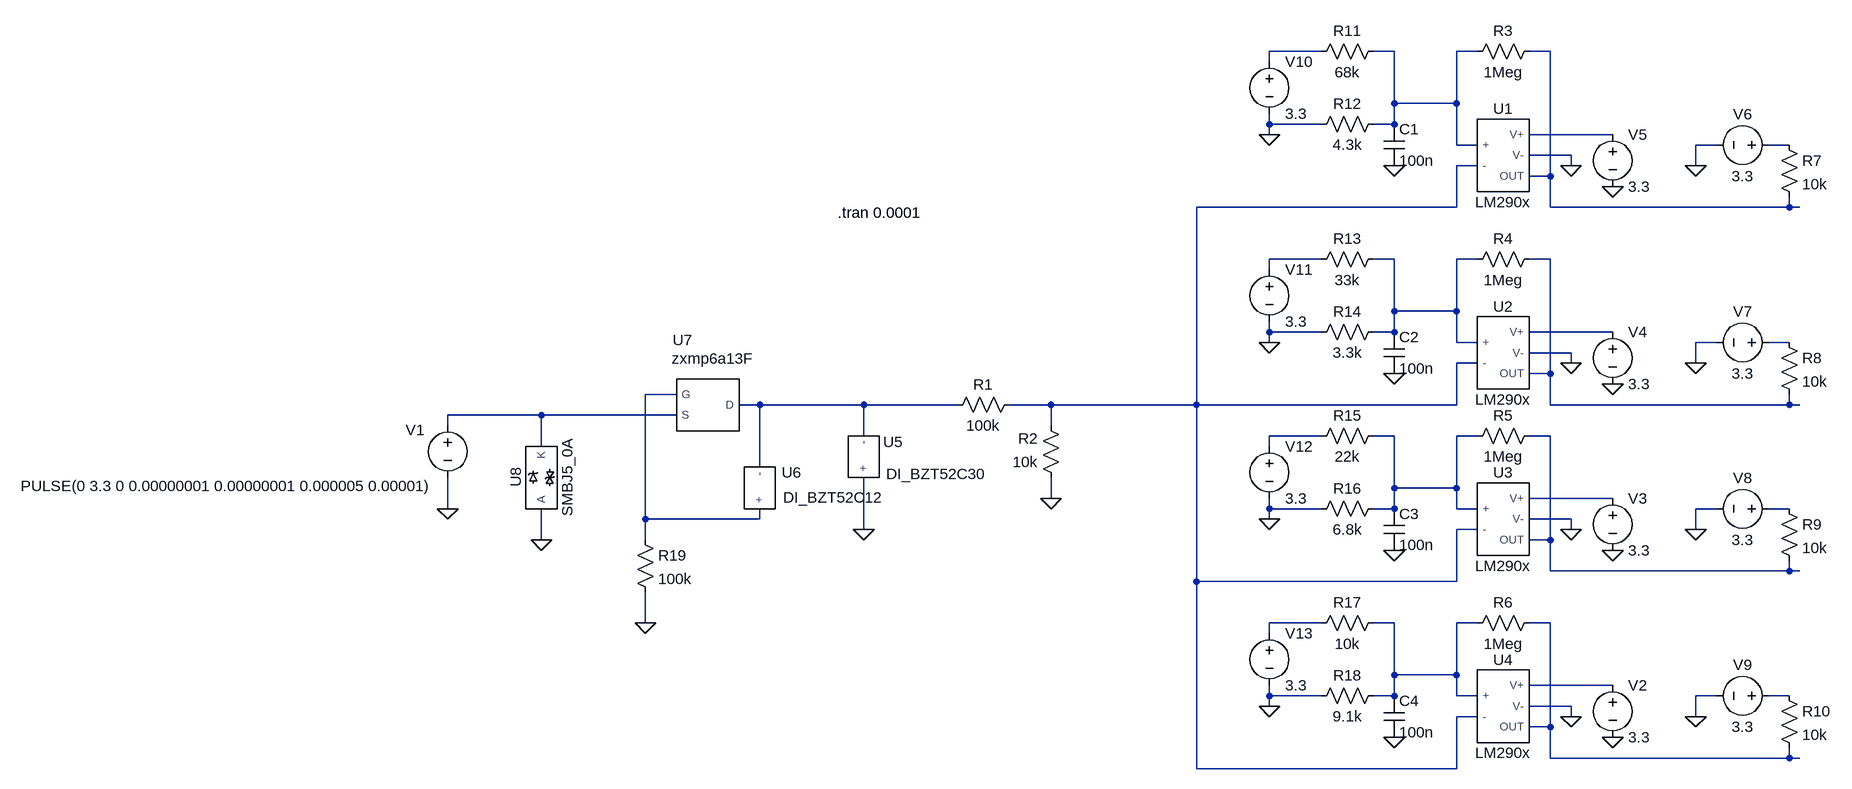
[diagram p0: schematic DigitalInput.asc]
DigitalInput.asc, the LTspice schematic file:
Version 4
SHEET 1 1332 868
WIRE 544 -240 464 -240
WIRE 656 -240 624 -240
WIRE 784 -240 752 -240
WIRE 896 -240 864 -240
WIRE 464 -224 464 -240
WIRE 656 -160 656 -240
WIRE 752 -160 752 -240
WIRE 752 -160 656 -160
WIRE 464 -128 464 -144
WIRE 544 -128 464 -128
WIRE 656 -128 656 -160
WIRE 656 -128 624 -128
WIRE 464 -112 464 -128
WIRE 992 -112 864 -112
WIRE 752 -96 752 -160
WIRE 784 -96 752 -96
WIRE 1152 -96 1120 -96
WIRE 1264 -96 1232 -96
WIRE 928 -80 864 -80
WIRE 784 -64 752 -64
WIRE 928 -64 928 -80
WIRE 1120 -64 1120 -96
WIRE 896 -48 896 -240
WIRE 896 -48 864 -48
WIRE 752 0 752 -64
WIRE 752 0 352 0
WIRE 896 0 896 -48
WIRE 1264 0 1264 -16
WIRE 1264 0 896 0
WIRE 1280 0 1264 0
WIRE 544 80 464 80
WIRE 656 80 624 80
WIRE 784 80 752 80
WIRE 896 80 864 80
WIRE 464 96 464 80
WIRE 656 160 656 80
WIRE 752 160 752 80
WIRE 752 160 656 160
WIRE 464 192 464 176
WIRE 544 192 464 192
WIRE 656 192 656 160
WIRE 656 192 624 192
WIRE 992 192 864 192
WIRE 464 208 464 192
WIRE 752 208 752 160
WIRE 784 208 752 208
WIRE 1152 208 1120 208
WIRE 1264 208 1232 208
WIRE 928 224 864 224
WIRE 784 240 752 240
WIRE 928 240 928 224
WIRE 1120 240 1120 208
WIRE 896 256 896 80
WIRE 896 256 864 256
WIRE -448 288 -496 288
WIRE -320 304 -352 304
WIRE -160 304 -320 304
WIRE -16 304 -160 304
WIRE 128 304 64 304
WIRE 352 304 352 0
WIRE 352 304 128 304
WIRE 752 304 752 240
WIRE 752 304 352 304
WIRE 896 304 896 256
WIRE 1264 304 1264 288
WIRE 1264 304 896 304
WIRE 1280 304 1264 304
WIRE -656 320 -800 320
WIRE -448 320 -656 320
WIRE -800 336 -800 320
WIRE 128 336 128 304
WIRE -160 352 -160 304
WIRE 544 352 464 352
WIRE 656 352 624 352
WIRE 784 352 752 352
WIRE 896 352 864 352
WIRE -656 368 -656 320
WIRE 464 368 464 352
WIRE -320 400 -320 304
WIRE 656 432 656 352
WIRE 752 432 752 352
WIRE 752 432 656 432
WIRE 128 448 128 416
WIRE 992 448 864 448
WIRE -800 464 -800 416
WIRE 464 464 464 448
WIRE 544 464 464 464
WIRE 656 464 656 432
WIRE 656 464 624 464
WIRE 752 464 752 432
WIRE 784 464 752 464
WIRE 1152 464 1120 464
WIRE 1264 464 1232 464
WIRE -496 480 -496 288
WIRE -320 480 -320 464
WIRE -320 480 -496 480
WIRE 464 480 464 464
WIRE 928 480 864 480
WIRE -160 496 -160 416
WIRE 784 496 752 496
WIRE 928 496 928 480
WIRE 1120 496 1120 464
WIRE -656 512 -656 464
WIRE -496 512 -496 480
WIRE 896 512 896 352
WIRE 896 512 864 512
WIRE 896 560 896 512
WIRE 1264 560 1264 544
WIRE 1264 560 896 560
WIRE 1280 560 1264 560
WIRE 352 576 352 304
WIRE 752 576 752 496
WIRE 752 576 352 576
WIRE -496 640 -496 592
WIRE 544 640 464 640
WIRE 656 640 624 640
WIRE 784 640 752 640
WIRE 896 640 864 640
WIRE 464 656 464 640
WIRE 656 720 656 640
WIRE 752 720 752 640
WIRE 752 720 656 720
WIRE 992 736 864 736
WIRE 464 752 464 736
WIRE 544 752 464 752
WIRE 656 752 656 720
WIRE 656 752 624 752
WIRE 752 752 752 720
WIRE 784 752 752 752
WIRE 1152 752 1120 752
WIRE 1264 752 1232 752
WIRE 464 768 464 752
WIRE 928 768 864 768
WIRE 784 784 752 784
WIRE 928 784 928 768
WIRE 1120 784 1120 752
WIRE 896 800 896 640
WIRE 896 800 864 800
WIRE 896 848 896 800
WIRE 1264 848 1264 832
WIRE 1264 848 896 848
WIRE 1280 848 1264 848
WIRE 352 864 352 576
WIRE 752 864 752 784
WIRE 752 864 352 864
FLAG -800 464 0
FLAG 128 448 0
FLAG 928 784 0
FLAG 992 816 0
FLAG 928 496 0
FLAG 992 528 0
FLAG 928 240 0
FLAG 992 272 0
FLAG 928 -64 0
FLAG 992 -32 0
FLAG 1120 -64 0
FLAG 1120 240 0
FLAG 1120 496 0
FLAG 1120 784 0
FLAG 464 -112 0
FLAG 656 -64 0
FLAG 464 208 0
FLAG 656 256 0
FLAG 464 480 0
FLAG 656 528 0
FLAG 464 768 0
FLAG 656 816 0
FLAG -656 512 0
FLAG -496 640 0
FLAG -160 496 0
SYMBOL res 80 288 R90
WINDOW 0 0 56 VBottom 2
WINDOW 3 32 56 VTop 2
SYMATTR InstName R1
SYMATTR Value 100k
SYMBOL res 144 432 R180
WINDOW 0 36 76 Left 2
WINDOW 3 36 40 Left 2
SYMATTR InstName R2
SYMATTR Value 10k
SYMBOL voltage -800 320 R0
WINDOW 0 -65 23 Left 2
WINDOW 3 -657 109 Left 2
WINDOW 123 0 0 Left 0
WINDOW 39 0 0 Left 0
SYMATTR InstName V1
SYMATTR Value PULSE(0 3.3 0 0.00000001 0.00000001 0.000005 0.00001)
SYMBOL LM290x 816 -80 R0
SYMATTR InstName U1
SYMBOL LM290x 816 224 R0
SYMATTR InstName U2
SYMBOL LM290x 816 480 R0
SYMATTR InstName U3
SYMBOL LM290x 816 768 R0
SYMATTR InstName U4
SYMBOL res 880 -256 R90
WINDOW 0 0 56 VBottom 2
WINDOW 3 32 56 VTop 2
SYMATTR InstName R3
SYMATTR Value 1Meg
SYMBOL res 880 64 R90
WINDOW 0 0 56 VBottom 2
WINDOW 3 32 56 VTop 2
SYMATTR InstName R4
SYMATTR Value 1Meg
SYMBOL res 880 336 R90
WINDOW 0 0 56 VBottom 2
WINDOW 3 32 56 VTop 2
SYMATTR InstName R5
SYMATTR Value 1Meg
SYMBOL res 880 624 R90
WINDOW 0 0 56 VBottom 2
WINDOW 3 32 56 VTop 2
SYMATTR InstName R6
SYMATTR Value 1Meg
SYMBOL voltage 992 720 R0
WINDOW 123 0 0 Left 0
WINDOW 39 0 0 Left 0
SYMATTR InstName V2
SYMATTR Value 3.3
SYMBOL voltage 992 432 R0
WINDOW 123 0 0 Left 0
WINDOW 39 0 0 Left 0
SYMATTR InstName V3
SYMATTR Value 3.3
SYMBOL voltage 992 176 R0
WINDOW 123 0 0 Left 0
WINDOW 39 0 0 Left 0
SYMATTR InstName V4
SYMATTR Value 3.3
SYMBOL voltage 992 -128 R0
WINDOW 123 0 0 Left 0
WINDOW 39 0 0 Left 0
SYMATTR InstName V5
SYMATTR Value 3.3
SYMBOL voltage 1248 -96 R90
WINDOW 0 -32 56 VBottom 2
WINDOW 3 32 56 VTop 2
WINDOW 123 0 0 Left 0
WINDOW 39 0 0 Left 0
SYMATTR InstName V6
SYMATTR Value 3.3
SYMBOL res 1248 -112 R0
SYMATTR InstName R7
SYMATTR Value 10k
SYMBOL voltage 1248 208 R90
WINDOW 0 -32 56 VBottom 2
WINDOW 3 32 56 VTop 2
WINDOW 123 0 0 Left 0
WINDOW 39 0 0 Left 0
SYMATTR InstName V7
SYMATTR Value 3.3
SYMBOL res 1248 192 R0
SYMATTR InstName R8
SYMATTR Value 10k
SYMBOL voltage 1248 464 R90
WINDOW 0 -32 56 VBottom 2
WINDOW 3 32 56 VTop 2
WINDOW 123 0 0 Left 0
WINDOW 39 0 0 Left 0
SYMATTR InstName V8
SYMATTR Value 3.3
SYMBOL res 1248 448 R0
SYMATTR InstName R9
SYMATTR Value 10k
SYMBOL voltage 1248 752 R90
WINDOW 0 -32 56 VBottom 2
WINDOW 3 32 56 VTop 2
WINDOW 123 0 0 Left 0
WINDOW 39 0 0 Left 0
SYMATTR InstName V9
SYMATTR Value 3.3
SYMBOL res 1248 736 R0
SYMATTR InstName R10
SYMATTR Value 10k
SYMBOL voltage 464 -240 R0
WINDOW 123 0 0 Left 0
WINDOW 39 0 0 Left 0
SYMATTR InstName V10
SYMATTR Value 3.3
SYMBOL res 640 -256 R90
WINDOW 0 0 56 VBottom 2
WINDOW 3 32 56 VTop 2
SYMATTR InstName R11
SYMATTR Value 68k
SYMBOL res 640 -144 R90
WINDOW 0 0 56 VBottom 2
WINDOW 3 32 56 VTop 2
SYMATTR InstName R12
SYMATTR Value 4.3k
SYMBOL cap 640 -128 R0
SYMATTR InstName C1
SYMATTR Value 100n
SYMBOL voltage 464 80 R0
WINDOW 123 0 0 Left 0
WINDOW 39 0 0 Left 0
SYMATTR InstName V11
SYMATTR Value 3.3
SYMBOL res 640 64 R90
WINDOW 0 0 56 VBottom 2
WINDOW 3 32 56 VTop 2
SYMATTR InstName R13
SYMATTR Value 33k
SYMBOL res 640 176 R90
WINDOW 0 0 56 VBottom 2
WINDOW 3 32 56 VTop 2
SYMATTR InstName R14
SYMATTR Value 3.3k
SYMBOL cap 640 192 R0
SYMATTR InstName C2
SYMATTR Value 100n
SYMBOL voltage 464 352 R0
WINDOW 123 0 0 Left 0
WINDOW 39 0 0 Left 0
SYMATTR InstName V12
SYMATTR Value 3.3
SYMBOL res 640 336 R90
WINDOW 0 0 56 VBottom 2
WINDOW 3 32 56 VTop 2
SYMATTR InstName R15
SYMATTR Value 22k
SYMBOL res 640 448 R90
WINDOW 0 0 56 VBottom 2
WINDOW 3 32 56 VTop 2
SYMATTR InstName R16
SYMATTR Value 6.8k
SYMBOL cap 640 464 R0
SYMATTR InstName C3
SYMATTR Value 100n
SYMBOL voltage 464 640 R0
WINDOW 123 0 0 Left 0
WINDOW 39 0 0 Left 0
SYMATTR InstName V13
SYMATTR Value 3.3
SYMBOL res 640 624 R90
WINDOW 0 0 56 VBottom 2
WINDOW 3 32 56 VTop 2
SYMATTR InstName R17
SYMATTR Value 10k
SYMBOL res 640 736 R90
WINDOW 0 0 56 VBottom 2
WINDOW 3 32 56 VTop 2
SYMATTR InstName R18
SYMATTR Value 9.1k
SYMBOL cap 640 752 R0
SYMATTR InstName C4
SYMATTR Value 100n
SYMBOL DI_BZT52C30 -160 384 R270
WINDOW 0 7 45 VTop 2
WINDOW 3 -11 112 VBottom 2
SYMATTR InstName U5
SYMBOL DI_BZT52C12 -320 432 R270
WINDOW 0 8 49 VTop 2
WINDOW 3 1 113 VBottom 2
SYMATTR InstName U6
SYMBOL zxmp6a13F -400 304 R180
WINDOW 0 39 115 Bottom 2
WINDOW 3 -8 56 Top 2
SYMATTR InstName U7
SYMBOL res -512 496 R0
SYMATTR InstName R19
SYMATTR Value 100k
SYMBOL smbj_thermal_05-07-25_lt -656 416 R270
SYMATTR InstName U8
TEXT -200 8 Left 2 !.tran 0.0001

The netlist it stands for:
* DigitalInput.asc
R1 N006 N013 100k
R2 0 N006 10k
V1 N014 0 PULSE(0 3.3 0 0.00000001 0.00000001 0.000005 0.00001)
XU1 N002 N006 N004 0 N003 LM290x  ; pins + - V+ V- OUT
XU2 N008 N006 N010 0 N009 LM290x  ; pins + - V+ V- OUT
XU3 N016 N006 N018 0 N017 LM290x  ; pins + - V+ V- OUT
XU4 N021 N006 N023 0 N022 LM290x  ; pins + - V+ V- OUT
R3 N003 N002 1Meg
R4 N009 N008 1Meg
R5 N017 N016 1Meg
R6 N022 N021 1Meg
V2 N023 0 3.3
V3 N018 0 3.3
V4 N010 0 3.3
V5 N004 0 3.3
V6 N005 0 3.3
R7 N005 N003 10k
V7 N011 0 3.3
R8 N011 N009 10k
V8 N019 0 3.3
R9 N019 N017 10k
V9 N024 0 3.3
R10 N024 N022 10k
V10 N001 0 3.3
R11 N002 N001 68k
R12 N002 0 4.3k
C1 N002 0 100n
V11 N007 0 3.3
R13 N008 N007 33k
R14 N008 0 3.3k
C2 N008 0 100n
V12 N015 0 3.3
R15 N016 N015 22k
R16 N016 0 6.8k
C3 N016 0 100n
V13 N020 0 3.3
R17 N021 N020 10k
R18 N021 0 9.1k
C4 N021 0 100n
XU5 0 N013 DI_BZT52C30  ; pins + -
XU6 N012 N013 DI_BZT52C12  ; pins + -
XU7 N013 N012 N014 zxmp6a13F  ; pins D G S
R19 N012 0 100k
XU8 0 N014 SMBJ5_0A  ; pins A K
.tran 0.0001
.lib lm290x.lib
.lib BZT52C30.lib
.lib BZT52C12.lib
.lib ZXMP6A13F.lib
.lib smbj_thermal_05-07-25_LT_encrypted.lib
.backanno
.end